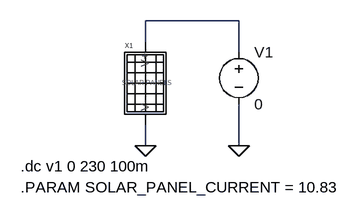
[diagram p0: schematic PV_panel.asc]
PV_panel.asc, the LTspice schematic file:
Version 4
SHEET 1 880 680
WIRE 352 80 208 80
WIRE 208 112 208 80
WIRE 352 128 352 80
WIRE 208 272 208 240
WIRE 352 272 352 208
FLAG 208 272 0
FLAG 352 272 0
SYMBOL EC370M-6-120FB_370_Wp 208 176 R0
SYMATTR InstName X1
SYMBOL voltage 352 112 R0
WINDOW 123 0 0 Left 0
WINDOW 39 0 0 Left 0
SYMATTR InstName V1
SYMATTR Value 0
TEXT 16 304 Left 2 !.dc v1 0 230 100m
TEXT 16 336 Left 2 !.PARAM SOLAR_PANEL_CURRENT = 10.83

The netlist it stands for:
* PV_panel.asc
XX1 0 N001 EC370M-6-120FB_370_Wp SOLAR_PANEL_CURRENT = {SOLAR_PANEL_CURRENT}  ; pins V- V+
V1 N001 0 0
.dc v1 0 230 100m
.PARAM SOLAR_PANEL_CURRENT = 10.83
.backanno
.end